# EAGLE schematic redBoard_r1 (EAGLE 7.1.0)

## Sheet 1 of 2
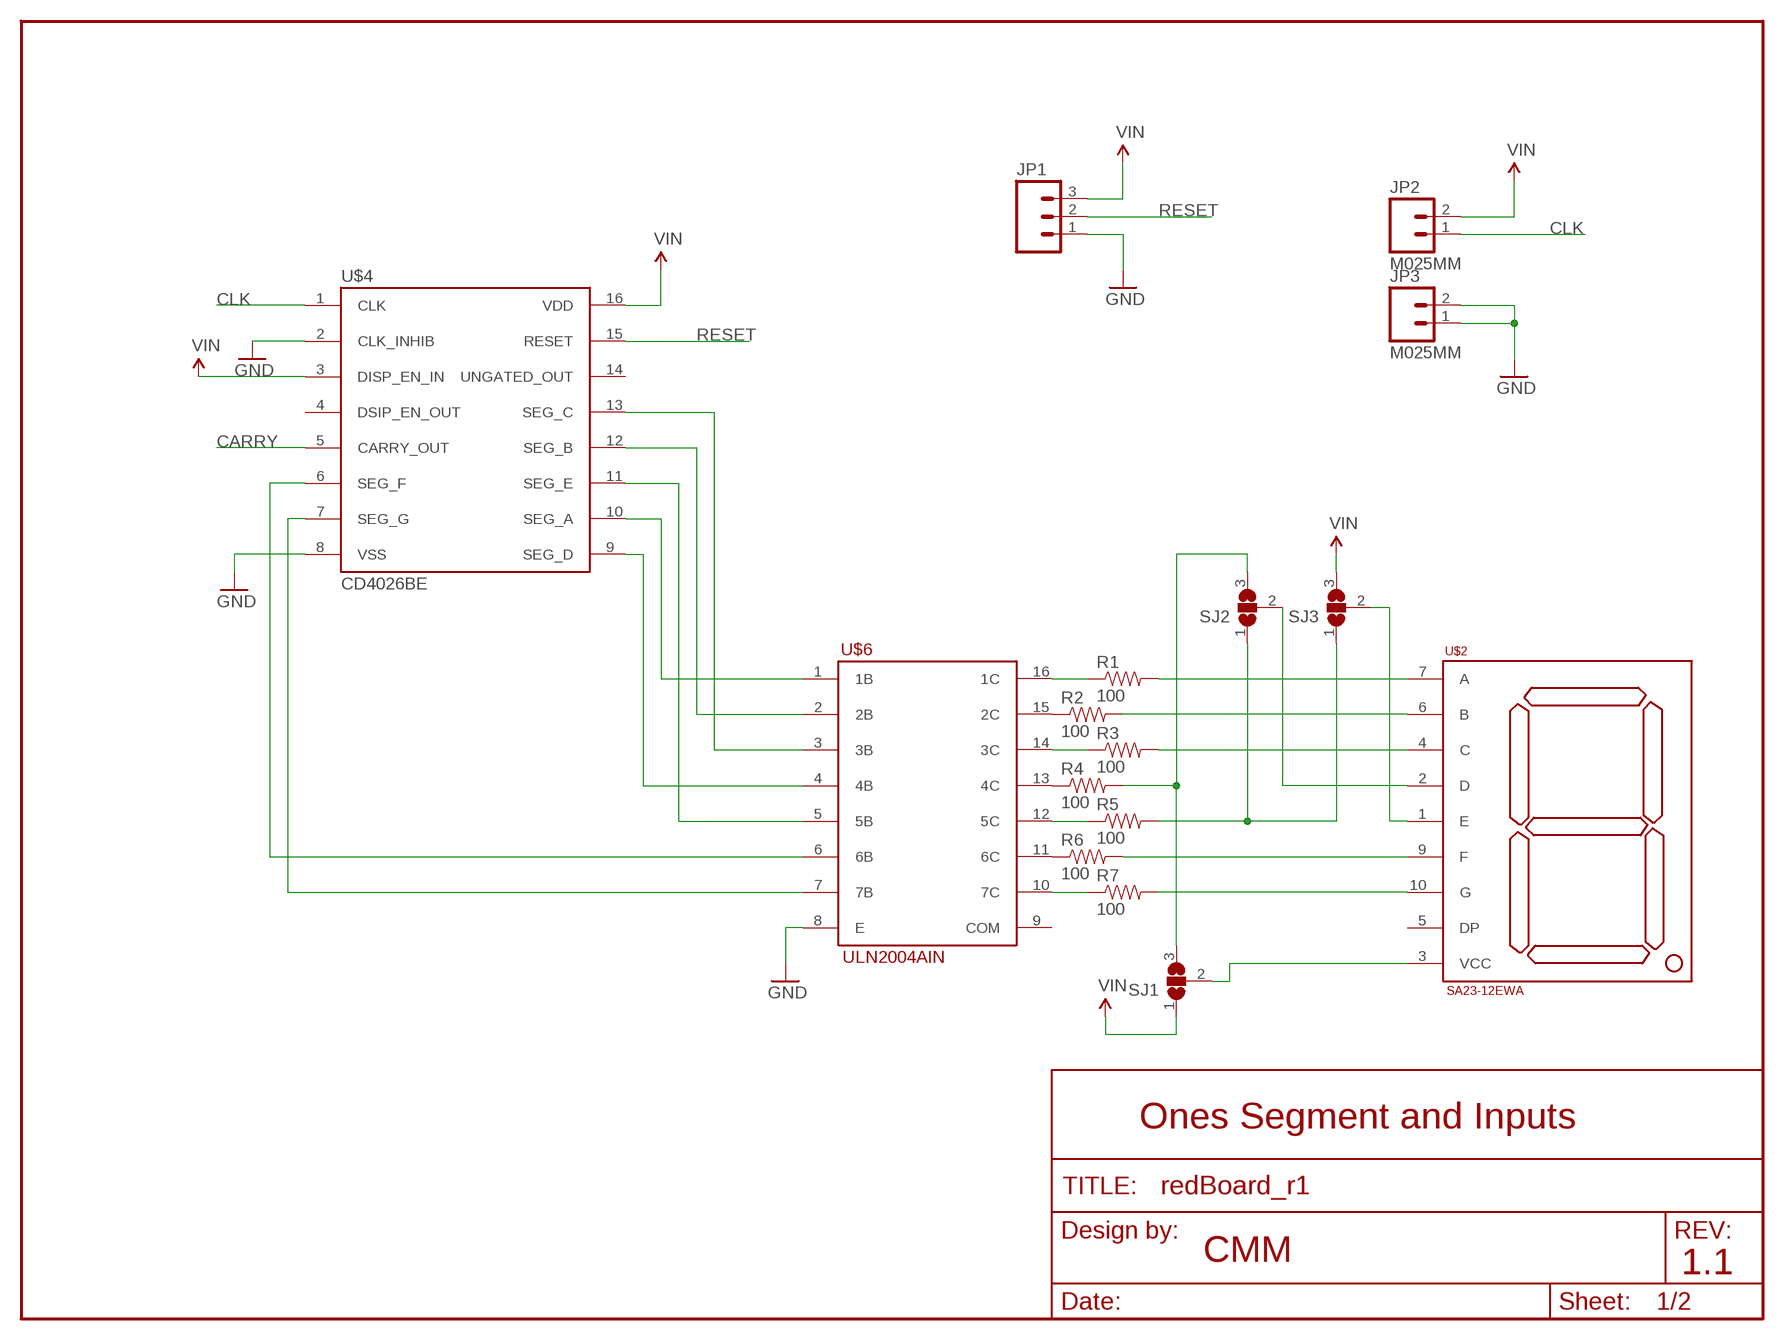
[diagram p0: schematic, sheet 1]

### Parts
FRAME2  FRAME-LETTERNOTEXT  [BLANK]
JP1  M03-SCREW-5MM  [SCREWTERMINAL-5MM-3]
JP2  M025MM  [SCREWTERMINAL-5MM-2]
JP3  M025MM  [SCREWTERMINAL-5MM-2]
R1  100  100OHM-1/4W-1%(PTH)  [AXIAL-0.3]
R2  100  100OHM-1/4W-1%(PTH)  [AXIAL-0.3]
R3  100  100OHM-1/4W-1%(PTH)  [AXIAL-0.3]
R4  100  100OHM-1/4W-1%(PTH)  [AXIAL-0.3]
R5  100  100OHM-1/4W-1%(PTH)  [AXIAL-0.3]
R6  100  100OHM-1/4W-1%(PTH)  [AXIAL-0.3]
R7  100  100OHM-1/4W-1%(PTH)  [AXIAL-0.3]
SJ1  SJ2W  [SJ_2]
SJ2  SJ2W  [SJ_2]
SJ3  SJ2W  [SJ_2]
U$2  SA23-12EWA  [7SEGMENT_23IN]
U$4  CD4026BE  [DIL16]
U$6  ULN2004AIN  [DIL16]

### Nets
CARRY: U$4.5(CARRY_OUT) ; also sheet 2
CLK: JP2.1 U$4.1(CLK)
GND: JP1.1 JP3.1 JP3.2 U$4.2(CLK_INHIB) U$4.8(VSS) U$6.8(E) ; also sheet 2
N$1: R1.P$2 U$2.7(A)
N$2: R2.P$2 U$2.6(B)
N$3: R3.P$2 U$2.4(C)
N$4: SJ3.2 U$2.1(E)
N$5: R5.P$2 SJ2.1 SJ3.1
N$6: R6.P$2 U$2.9(F)
N$7: R7.P$2 U$2.10(G)
N$8: R1.P$1 U$6.16(1C)
N$9: R2.P$1 U$6.15(2C)
N$10: R3.P$1 U$6.14(3C)
N$11: R4.P$1 U$6.13(4C)
N$12: R5.P$1 U$6.12(5C)
N$13: R6.P$1 U$6.11(6C)
N$14: R7.P$1 U$6.10(7C)
N$29: U$4.9(SEG_D) U$6.4(4B)
N$30: U$4.10(SEG_A) U$6.1(1B)
N$31: U$4.11(SEG_E) U$6.5(5B)
N$32: U$4.12(SEG_B) U$6.2(2B)
N$33: U$4.13(SEG_C) U$6.3(3B)
N$34: U$4.6(SEG_F) U$6.6(6B)
N$35: U$4.7(SEG_G) U$6.7(7B)
N$43: SJ1.2 U$2.3(VCC)
N$44: SJ2.2 U$2.2(D)
N$45: R4.P$2 SJ1.3 SJ2.3
RESET: JP1.2 U$4.15(RESET) ; also sheet 2
VIN: JP1.3 JP2.2 SJ1.1 SJ3.3 U$4.3(DISP_EN_IN) U$4.16(VDD) ; also sheet 2
Unconnected: U$2.5(DP) U$4.4(DSIP_EN_OUT) U$4.14(UNGATED_OUT) U$6.9(COM)

### Notes on the sheet
- Ones Segment and Inputs
- CMM
- 1.1

## Sheet 2 of 2
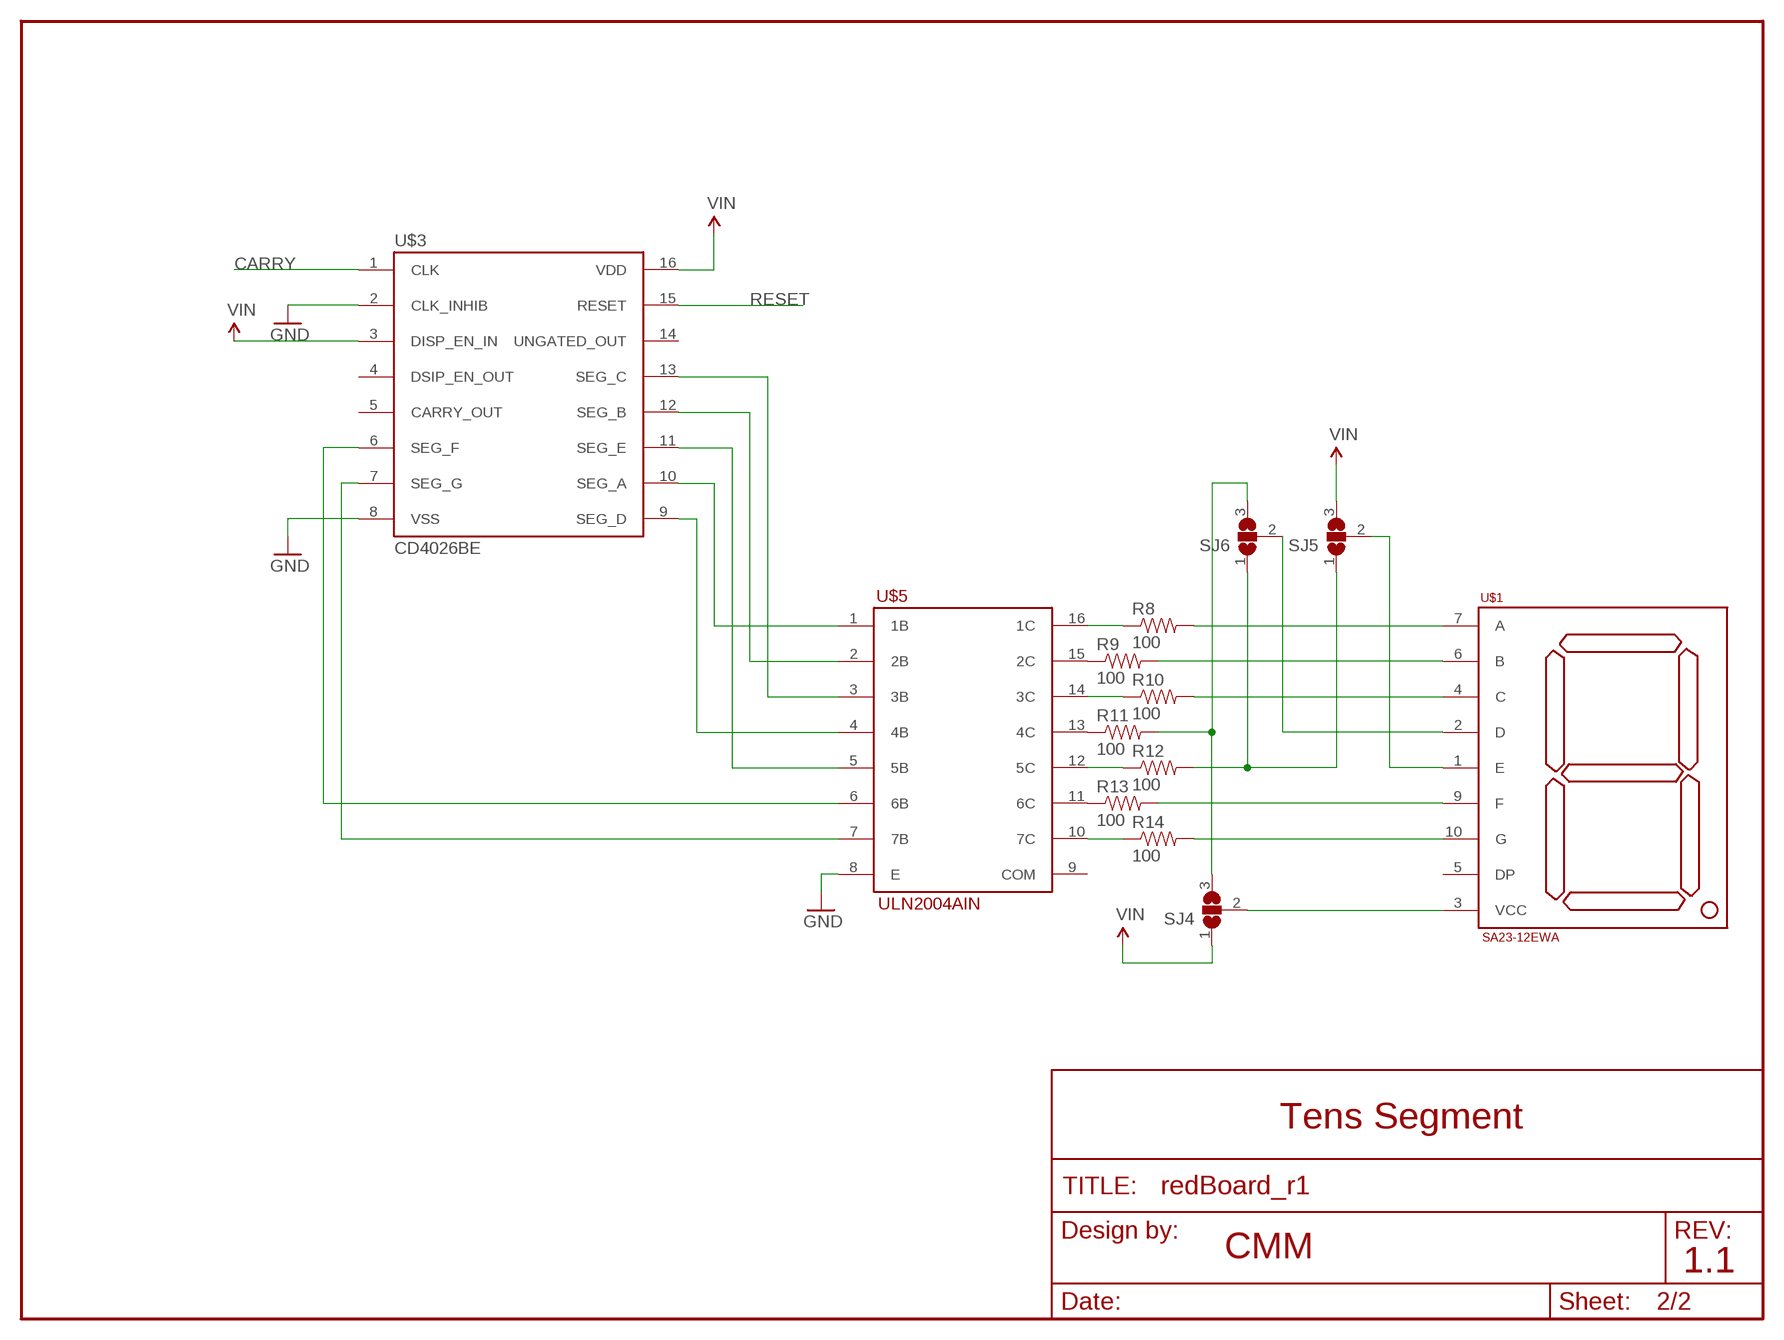
[diagram p1: schematic, sheet 2]

### Parts
FRAME1  FRAME-LETTERNOTEXT  [BLANK]
R8  100  100OHM-1/4W-1%(PTH)  [AXIAL-0.3]
R9  100  100OHM-1/4W-1%(PTH)  [AXIAL-0.3]
R10  100  100OHM-1/4W-1%(PTH)  [AXIAL-0.3]
R11  100  100OHM-1/4W-1%(PTH)  [AXIAL-0.3]
R12  100  100OHM-1/4W-1%(PTH)  [AXIAL-0.3]
R13  100  100OHM-1/4W-1%(PTH)  [AXIAL-0.3]
R14  100  100OHM-1/4W-1%(PTH)  [AXIAL-0.3]
SJ4  SJ2W  [SJ_2]
SJ5  SJ2W  [SJ_2]
SJ6  SJ2W  [SJ_2]
U$1  SA23-12EWA  [7SEGMENT_23IN]
U$3  CD4026BE  [DIL16]
U$5  ULN2004AIN  [DIL16]

### Nets
CARRY: U$3.1(CLK) ; also sheet 1
GND: U$3.2(CLK_INHIB) U$3.8(VSS) U$5.8(E) ; also sheet 1
N$15: R14.P$2 U$1.10(G)
N$16: R13.P$2 U$1.9(F)
N$17: SJ5.2 U$1.1(E)
N$18: R12.P$2 SJ5.1 SJ6.1
N$19: R10.P$2 U$1.4(C)
N$20: R9.P$2 U$1.6(B)
N$21: R8.P$2 U$1.7(A)
N$22: R8.P$1 U$5.16(1C)
N$23: R9.P$1 U$5.15(2C)
N$24: R10.P$1 U$5.14(3C)
N$25: R11.P$1 U$5.13(4C)
N$26: R12.P$1 U$5.12(5C)
N$27: R13.P$1 U$5.11(6C)
N$28: R14.P$1 U$5.10(7C)
N$36: U$3.9(SEG_D) U$5.4(4B)
N$37: U$3.10(SEG_A) U$5.1(1B)
N$38: U$3.11(SEG_E) U$5.5(5B)
N$39: U$3.12(SEG_B) U$5.2(2B)
N$40: U$3.13(SEG_C) U$5.3(3B)
N$41: U$3.6(SEG_F) U$5.6(6B)
N$42: U$3.7(SEG_G) U$5.7(7B)
N$46: SJ6.2 U$1.2(D)
N$47: R11.P$2 SJ4.3 SJ6.3
N$48: SJ4.2 U$1.3(VCC)
RESET: U$3.15(RESET) ; also sheet 1
VIN: SJ4.1 SJ5.3 U$3.3(DISP_EN_IN) U$3.16(VDD) ; also sheet 1
Unconnected: U$1.5(DP) U$3.4(DSIP_EN_OUT) U$3.5(CARRY_OUT) U$3.14(UNGATED_OUT) U$5.9(COM)

### Notes on the sheet
- Tens Segment
- CMM
- 1.1

## Library data of the parts
FRAME1 FRAME2 = SparkFun-Aesthetics:FRAME-LETTER: Schematic Frame Standard 8.5x11 US Letter frame
JP1 = SparkFun-Connectors:M03: Header 3 Standard 3-pin 0.1" header. Use with straight break away headers (SKU : PRT-00116), right angle break away headers (PRT-00553), swiss pins (PRT-00743), machine pins (PRT-00117), and female headers (PRT-00115). Molex polarized connector foot print use with SKU : PRT-08232 with associated crimp pins and housings.
JP2 JP3 = SparkFun-Connectors:M02: Standard 2-pin 0.1" header. Use with - straight break away headers ( PRT-00116) - right angle break away headers (PRT-00553) - swiss pins (PRT-00743) - machine pins (PRT-00117) - female headers (PRT-00115) Molex polarized connector foot print use with: PRT-08233 with associated crimp pins and housings. 2.54_SCREWTERM for use with PRT-10571. 3.5mm Screw Terminal footprints for PRT-08084 5mm Screw Terminal footprints for use with PRT-08433
R1-R14 = SparkFun-Resistors:100OHM-1/4W-1%(PTH): RES-12181; PROD_ID: RES-12181
SJ1-SJ6 = jumper:SJ2W: SMD solder JUMPER
U$1 U$2 = myLibrary:SA23-
U$3 U$4 = myLibrary:CD4026: CMOS Decade Counters/Dividers Counter and decoder for 7-Segement displays.
U$5 U$6 = myLibrary:ULN2004